# EAGLE design Control (EAGLE 9.6.2)
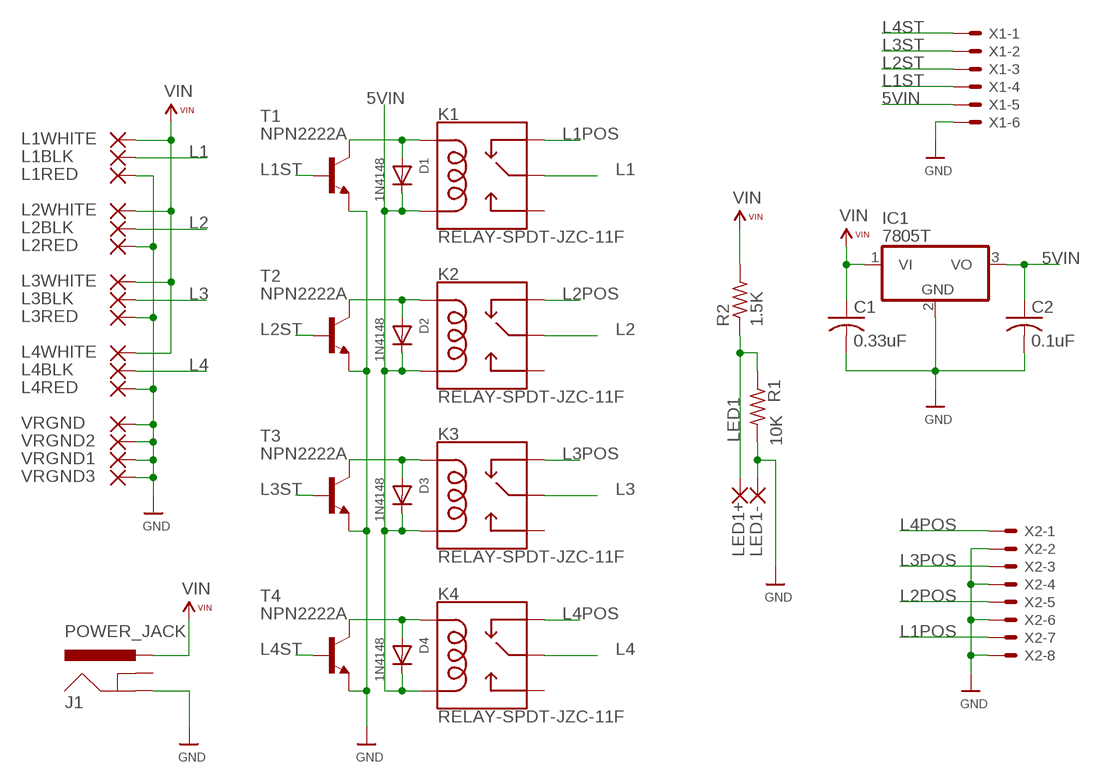
[diagram p0: schematic, sheet 1]

## Parts
C1  0.33uF  C-USC1206  [C1206]
C2  0.1uF  C-USC1206  [C1206]
D1  1N4148  DIODEDO-1N4148  [DO-1N4148]
D2  1N4148  DIODEDO-1N4148  [DO-1N4148]
D3  1N4148  DIODEDO-1N4148  [DO-1N4148]
D4  1N4148  DIODEDO-1N4148  [DO-1N4148]
IC1  7805T  [TO220H]
J1  POWER_JACK  [POWER_JACK_PTH]
K1  RELAY-SPDT-JZC-11F  [RELAY-JZC]
K2  RELAY-SPDT-JZC-11F  [RELAY-JZC]
K3  RELAY-SPDT-JZC-11F  [RELAY-JZC]
K4  RELAY-SPDT-JZC-11F  [RELAY-JZC]
L1BLK  SMD5  [SMD5,5X5]
L1RED  SMD5  [SMD5,5X5]
L1WHITE  SMD5  [SMD5,5X5]
L2BLK  SMD5  [SMD5,5X5]
L2RED  SMD5  [SMD5,5X5]
L2WHITE  SMD5  [SMD5,5X5]
L3BLK  SMD5  [SMD5,5X5]
L3RED  SMD5  [SMD5,5X5]
L3WHITE  SMD5  [SMD5,5X5]
L4BLK  SMD5  [SMD5,5X5]
L4RED  SMD5  [SMD5,5X5]
L4WHITE  SMD5  [SMD5,5X5]
LED1+  SMD5  [SMD2,54-5,08]
LED1-  SMD5  [SMD2,54-5,08]
R1  10K  R-US_M1206  [M1206]
R2  1.5K  R-US_M1206  [M1206]
T1  NPN2222A  2N5088  [TO92]
T2  NPN2222A  2N5088  [TO92]
T3  NPN2222A  2N5088  [TO92]
T4  NPN2222A  2N5088  [TO92]
VRGND  SMD5  [SMD5,5X5]
VRGND1  SMD5  [SMD5,5X5]
VRGND2  SMD5  [SMD5,5X5]
VRGND3  SMD5  [SMD5,5X5]
X1  KK-156-6  [KK-156-6]
X2  KK-156-8  [KK-156-8]

## Nets
5VIN: C2.1 D1.C D2.C D3.C D4.C IC1.3(VO) K1.1(COIL2) K2.1(COIL2) K3.1(COIL2) K4.1(COIL2) X1.5
GND: C1.2 C2.2 IC1.2(GND) J1.GND L1RED.1(P) L2RED.1(P) L3RED.1(P) L4RED.1(P) LED1-.1(P) R1.2 T1.3(E) T2.3(E) T3.3(E) T4.3(E) VRGND1.1(P) VRGND2.1(P) VRGND3.1(P) VRGND.1(P) X1.6 X2.2 X2.4 X2.6 X2.8
L1: K1.4(MAIN) L1BLK.1(P)
L1POS: K1.2(NC) X2.7
L1ST: T1.2(B) X1.4
L2: K2.4(MAIN) L2BLK.1(P)
L2POS: K2.2(NC) X2.5
L2ST: T2.2(B) X1.3
L3: K3.4(MAIN) L3BLK.1(P)
L3POS: K3.2(NC) X2.3
L3ST: T3.2(B) X1.2
L4: K4.4(MAIN) L4BLK.1(P)
L4POS: K4.2(NC) X2.1
L4ST: T4.2(B) X1.1
LED1: LED1+.1(P) R1.1 R2.1
N$6: D2.A K2.5(COIL1) T2.1(C)
N$7: D1.A K1.5(COIL1) T1.1(C)
N$8: D3.A K3.5(COIL1) T3.1(C)
N$9: D4.A K4.5(COIL1) T4.1(C)
VIN: C1.1 IC1.1(VI) J1.PWR L1WHITE.1(P) L2WHITE.1(P) L3WHITE.1(P) L4WHITE.1(P) R2.2
Unconnected: J1.GNDBREAK K1.3(NO) K2.3(NO) K3.3(NO) K4.3(NO)

## Library data of the parts
C1 C2 = adafruit:C-US: CAPACITOR, American symbol
D1-D4 = adafruit:DIODE: Diode SMADIODE - SMA Surface Mount Package 20V 1A Schottky Diode Digikey: 641-1014-6-ND DO-1N4148 - Through Hole Small Current Diode SOD-123 20V 1 A (.5mV Vf) Schottky Diode - Digikey: MBRX120TPMSCT-ND SOD-323 10V 570mA (.38mV Vf, 3ns) Schottky Diode - Digikey: ZLLS410CT-ND SOD-523 30V 30mA Schottky Diode (RB751S-40TE61) - Digikey: RB751S-40TE61CT-ND SOT23-R/W - SOT23 Package (R = Solder Paste/Reflow Ovens, W = Hand-Soldering) BAT54Film 40V 300mA - Digikey: 497-7162-1-ND
IC1 = linear:78*: Positive VOLTAGE REGULATOR Source: http://cache.national.com/ds/LM/LM78L05.pdf http://www.fairchildsemi.com/ds/LM/LM7805.pdf
J1 = SparkFun-Connectors:POWER_JACK: Power Jack Connector This is the standard 5.5mm barrel jack for power. The PTH is the most common, proven, reliable, footprint. The Slot footprint only works if the mill layer is transmitted to the PCB fab house so be warned. Here are the connectors we sell at SparkFun: DC Barrel Power Jack/Connector <https://www.sparkfun.com/products/119> (PRT-00119) DC Barrel Power Jack/Connector (SMD) <https://www.sparkfun.com/products/12748> (PRT-12748) DC Barrel Jack Adapter - Breadboard Compatible <https://www.sparkfun.com/products/10811> (PRT-10811) It is used on this SparkFun product (and many, many others): SparkFun RedBoard - Programmed with Arduino <https://www.sparkfun.com/products/12757> (DEV-12757) Also, if you need a mating power supply or connector, please check these out: Wall Adapter Power Supply - 9VDC 650mA <https://www.sparkfun.com/products/298> (TOL-00298) DC Barrel Jack Adapter - Male <https://www.sparkfun.com/products/10287> (PRT-10287); PROD_ID: CONN-08197
K1-K4 = SparkFun-Electromechanical:RELAY-SPDT: SPDT Electromechanical Relay Single-pole, double-throw sealed relays. When current is applied to the coil, it throws a simple changeover switch, terminating the connection from the NC contact to ground and closing the NO contact. Use them to switch high voltage/high current devices. SparkFun Products JQX-15F: Relay SPDT Sealed - 20A <https://www.sparkfun.com/products/10924> (COM-10924) JZC-11F: Relay SPDT Sealed <https://www.sparkfun.com/products/100> (COM-00100); PROD_ID: COMP-09533; SF_SKU: COM-00100
L1BLK L1RED L1WHITE L2BLK L2RED L2WHITE L3BLK L3RED L3WHITE L4BLK L4RED L4WHITE VRGND VRGND1-VRGND3 = Wirepad 5x5mm:SMD5: SMD PAD
LED1+ LED1- = wirepad:SMD5: SMD PAD
R1 R2 = BeagleBone_Black_Wireless:R-US_: RESISTOR, American symbol
T1-T4 = transistor:2N5088: NPN TRANSISTOR
X1 = con-molex:KK-156-6: KK 156 HEADER Source: http://www.molex.com/pdm_docs/sd/026604100_sd.pdf; MF: MOLEX; OC_FARNELL: unknown; OC_NEWARK: unknown
X2 = con-molex:KK-156-8: KK 156 HEADER Source: http://www.molex.com/pdm_docs/sd/026604100_sd.pdf; MF: MOLEX; OC_FARNELL: unknown; OC_NEWARK: unknown

## Board
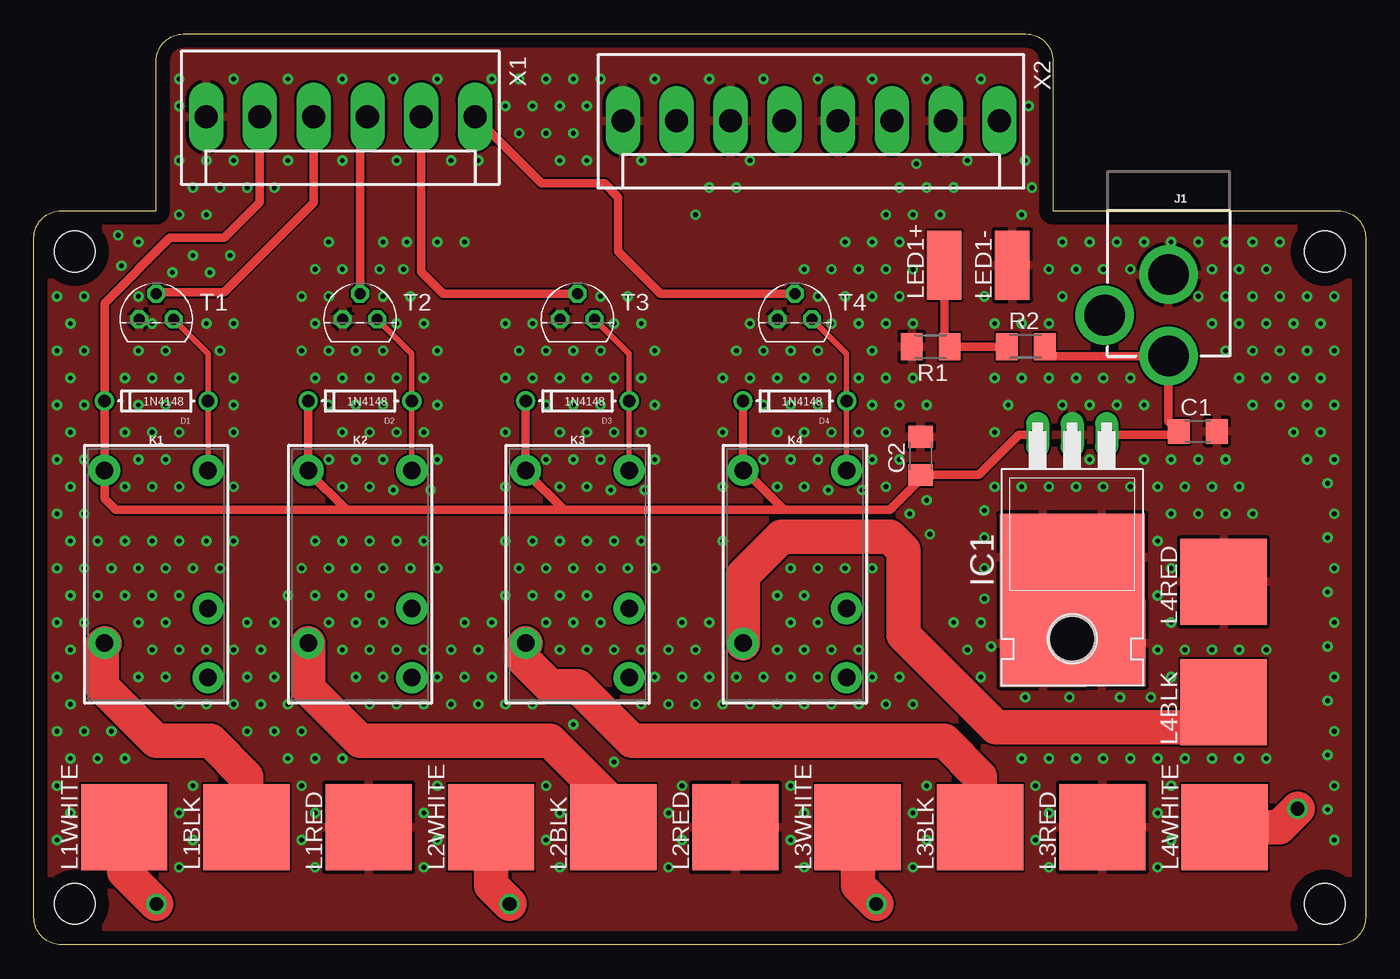
[diagram p1: board, top side]
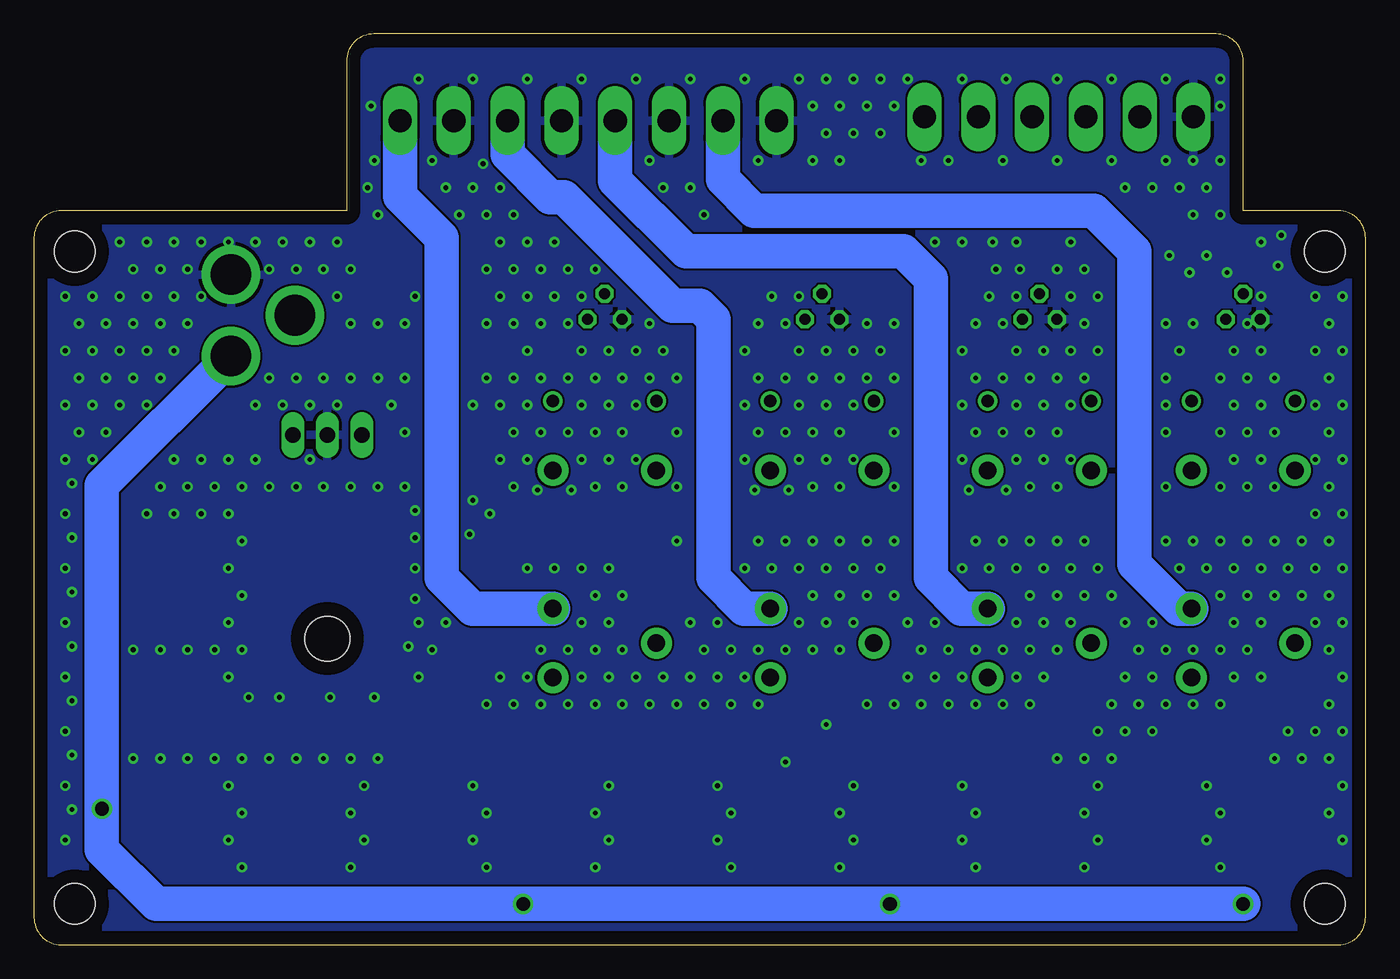
[diagram p2: board, bottom side, seen from below]

Size 98 x 67 mm. Coordinates in mm from the lower left corner, seen from the top.
Outline: 75,54 96,54 arc-90 98,52 98,2 arc-90 96,0 2,0 arc-90 0,2 0,52 arc-90 2,54 9,54 9,65 arc-90 11,67 73,67 arc-90 75,65 75,54
Copper layers (1*16): Top 0.035mm / dielectric 1.5mm / Bottom 0.035mm
Design rules "default": minimum track width 6mil, minimum drill 0.35mm, track to track 6mil, track to pad 6mil, pad to pad 6mil, via to via 6mil, smd to smd 6mil, copper to edge 40mil, drill to drill 6mil, minimum pad ring 10mil, minimum via ring 8mil, stop-mask expansion 4mil, vias tented up to drill 0.5mm, thermal gap 10mil
Holes 3 mm at 3,51 3,3 95,3 95,51

### Footprints (pad centres in the part's own frame; a part is rotated, then mirrored left to right if it is on the bottom)
C1206 = smd 1.6 x 1.8: 1 -1.4,0; 2 1.4,0
DO-1N4148 = drill 0.9: A -3.81,0; C 3.81,0
TO220H = drill 1.118 long: 1 -2.54,-10.16; 2 0,-10.16; 3 2.54,-10.16 | hole 3.302: 0,4.826
POWER_JACK_PTH = drill 2.997 pad 4.318: GND 0,7.7; GNDBREAK 4.7,10.7; PWR 0,13.7
RELAY-JZC = drill 1.3 pad 2.286: 1 3.81,-8.89; 2 -3.81,1.27; 3 -3.81,6.35; 4 3.81,3.81; 5 -3.81,-8.89
SMD5,5X5 = smd 6.35 x 6.35: 1 0.635,0.635
SMD2,54-5,08 = smd 2.54 x 5.08: 1 0,0
M1206 = smd 1.6 x 2: 1 -1.4,0; 2 1.4,0
TO92 = drill 0.813 octagon: 1 1.27,0; 2 0,1.905; 3 -1.27,0
KK-156-6 = drill 1.7 pad 2.184 long: 1 -9.9,0; 2 -5.94,0; 3 -1.98,0; 4 1.98,0; 5 5.94,0; 6 9.9,0
KK-156-8 = drill 1.7 pad 2.184 long: 1 -13.86,0; 2 -9.9,0; 3 -5.94,0; 4 -1.98,0; 5 1.98,0; 6 5.94,0; 7 9.9,0; 8 13.86,0

### Placement (x,y rotation side)
C1  85.65,37.77 0 top
C2  65.25,35.96 90 top
D1  9,40 180 top
D2  24,40 180 top
D3  40,40 180 top
D4  56,40 180 top
IC1  76.41,27.34 180 top
J1  83.5,57 180 top
K1  9,26 180 top
K2  24,26 180 top
K3  40,26 180 top
K4  56,26 180 top
L1BLK  15,8 0 top
L1RED  24,8 0 top
L1WHITE  6,8 0 top
L2BLK  42,8 0 top
L2RED  51,8 0 top
L2WHITE  33,8 0 top
L3BLK  69,8 0 top
L3RED  78,8 0 top
L3WHITE  60,8 0 top
L4BLK  86.92,17.2 0 top
L4RED  86.92,26.07 0 top
L4WHITE  87,8 0 top
LED1+  67,50 0 top
LED1-  72,50 0 top
R1  66,44 180 top
R2  73,44 0 top
T1  9,46 0 top
T2  24,46 0 top
T3  40,46 0 top
T4  56,46 0 top
VRGND  77.97,21.55 0 top
VRGND1  73.62,27.88 0 top
VRGND2  77.95,27.88 0 top
VRGND3  73.62,21.53 0 top
X1  22.56,60.9 180 top
X2  57.2,60.63 180 top

### Tracks (layer width: path | path; a pad name or v marks a point on that pad's centre or on a via)
5VIN
  Top 0.61: D2.C K2.1 20.19,34.81 23,32 | D3.C K3.1 36.19,34.81 39,32 | K4.1 52.19,35 | 52.19,35 D4.C | 23,32 6,32 5.19,32.81 K1.1 D1.C 5.19,47.19 10,52 14,52 16.62,54.62 X1.5 | 23,32 39,32 | 39,32 55.19,32 | 55.19,32 63,32 65.25,34.25 C2.1 69.56,34.56 72.5,37.5 IC1.3 | 55.19,32 52.19,35
GND  (via drill 0.35)
  other vias: 1.7,7.7 2.7,9.7 1.7,11.7 2.7,13.7 1.7,15.7 2.7,17.7 1.7,19.7 2.7,21.7 1.7,23.7 2.7,25.7 1.7,27.7 2.7,29.7 1.7,31.7 2.7,33.7 1.7,35.7 2.7,37.7 1.7,39.7 2.7,41.7 1.7,43.7 2.7,45.7 1.7,47.7 4.7,13.7 3.7,15.7 3.7,23.7 4.7,25.7 3.7,27.7 4.7,29.7 3.7,31.7 3.7,35.7 3.7,39.7 3.7,43.7 3.7,47.7 6.7,13.7 5.7,15.7 6.7,25.7 5.7,27.7 6.7,29.7 6.7,33.7 6.7,37.7 6.7,41.7 6.45,49.95 6.2,52.2 7.7,19.7 8.7,21.7 7.7,23.7 8.7,25.7 7.7,27.7 8.7,29.7 8.7,33.7 7.7,35.7 8.7,37.7 7.7,39.7 8.7,41.7 7.7,43.7 8.7,45.7 7.7,47.7 7.7,51.7 10.7,5.7 10.7,9.7 10.7,17.7 9.7,19.7 10.7,21.7 9.7,23.7 10.7,25.7 9.7,27.7 10.7,29.7 10.7,33.7 9.7,35.7 10.7,37.7 9.7,39.7 10.7,41.7 9.7,43.7 10.2,49.45 10.7,53.7 10.7,57.7 10.7,61.7 11.7,7.7 11.7,11.7 12.7,17.7 12.7,21.7 11.7,27.7 12.7,29.7 12.7,45.7 12.95,49.45 12.7,53.7 11.7,55.7 12.7,57.7 10.7,63.7 14.7,17.7 14.7,21.7 13.7,27.7 14.7,29.7 14.7,33.7 14.7,37.7 14.7,39.7 14.7,41.7 13.7,43.7 14.7,45.7 14.45,50.7 13.7,55.7 14.7,57.7 14.7,63.7 15.7,15.7 16.7,17.7 15.7,19.7 16.7,21.7 15.7,23.7 11.7,50.7 15.7,55.7 18.7,13.7 17.7,15.7 18.7,17.7 17.7,19.7 17.7,23.7 18.7,25.7 17.7,55.7 18.7,57.7 18.7,63.7 20.7,5.7 19.7,7.7 20.7,9.7 19.7,11.7 20.7,13.7 19.7,15.7 20.7,25.7 19.7,27.7 20.7,29.7 20.7,41.7 19.7,43.7 20.7,45.7 19.7,47.7 20.7,49.7 22.7,13.7 22.7,21.7 21.7,23.7 22.7,25.7 21.7,27.7 22.7,29.7 22.7,33.7 21.7,35.7 22.7,37.7 21.7,39.7 22.7,41.7 21.7,43.7 21.7,47.7 22.7,49.7 21.7,51.7 22.7,57.7 22.7,63.7 24.7,17.7 23.7,19.7 24.7,21.7 23.7,23.7 24.7,25.7 23.7,27.7 24.7,29.7 24.7,33.7 23.7,35.7 24.7,37.7 23.7,39.7 24.7,41.7 23.7,43.7 25.45,49.7 26.7,17.7 25.7,19.7 26.7,21.7 25.7,23.7 25.7,27.7 26.7,29.7 26.45,33.45 25.7,35.7 26.7,37.7 25.7,39.7 26.7,41.7 25.7,43.7 26.7,45.7 25.7,47.7 27.2,49.7 25.7,51.7 26.7,57.7 26.45,63.7 28.7,5.7 28.7,9.7 28.7,17.7 28.7,21.7 27.7,27.7 28.7,29.7 29.2,33.45 28.7,37.7 28.7,41.7 28.7,45.7 27.7,47.7 27.45,51.7 29.7,7.7 29.7,11.7 30.7,17.7 29.7,19.7 30.7,21.7 29.7,27.7 29.7,35.7 29.7,39.7 29.7,43.7 29.7,51.7 30.7,57.7 29.7,63.7 32.7,17.7 31.7,19.7 32.7,21.7 31.7,23.7 31.7,51.7 32.7,57.7 34.7,17.7 33.7,19.7 33.7,23.7 34.7,25.7 34.7,29.7 34.7,33.7 34.7,37.7 34.7,41.7 34.7,45.7 34.7,61.7 33.7,63.7 36.7,17.7 36.7,25.7 35.7,27.7 36.7,29.7 36.7,41.7 35.7,43.7 36.7,45.7 35.7,59.7 36.7,61.7 35.7,63.7 38.7,5.7 37.7,7.7 38.7,9.7 37.7,11.7 38.7,21.7 37.7,23.7 38.7,25.7 37.7,27.7 38.7,29.7 38.7,33.7 37.7,35.7 38.7,37.7 37.7,39.7 38.7,41.7 37.7,43.7 38.7,57.7 37.7,59.7 38.7,61.7 37.7,63.7 39.7,16.2 40.7,21.7 39.7,23.7 40.7,25.7 39.7,27.7 40.7,29.7 40.7,33.7 39.7,35.7 40.7,37.7 39.7,39.7 40.7,41.7 39.7,43.7 40.7,57.7 39.7,59.7 40.7,61.7 39.7,63.7 42.7,13.45 42.7,21.7 41.7,23.7 41.7,27.7 42.7,29.7 42.45,33.45 41.7,35.7 42.7,37.7 41.7,39.7 42.7,41.7 41.7,43.7 42.7,45.7 41.7,47.7 41.7,63.7 44.7,17.7 44.7,21.7 43.7,27.7 44.7,29.7 44.95,33.45 44.7,37.7 44.7,41.7 44.7,45.7 43.7,47.7 44.7,57.7 46.7,5.7 46.7,9.7 46.7,17.7 45.7,19.7 46.7,21.7 45.7,27.7 45.7,35.7 45.7,39.7 45.7,43.7 45.7,63.7 47.7,7.7 47.7,11.7 48.7,17.7 47.7,19.7 48.7,21.7 47.7,23.7 48.7,53.7 50.7,17.7 49.7,19.7 49.7,23.7 50.7,29.7 50.7,33.7 50.7,37.7 50.7,41.7 49.7,55.7 49.7,63.7 52.7,17.7 51.7,19.7 52.7,41.7 51.7,43.7 52.7,45.7 51.7,55.7 52.7,57.7 54.7,17.7 53.7,19.7 54.7,21.7 54.7,25.7 54.7,33.7 53.7,35.7 54.7,37.7 53.7,39.7 54.7,41.7 53.7,43.7 53.7,63.7 56.7,5.7 55.7,7.7 56.7,9.7 55.7,11.7 56.7,17.7 55.7,19.7 56.7,21.7 55.7,23.7 56.7,25.7 55.7,27.7 56.7,33.7 55.7,35.7 56.7,37.7 55.7,39.7 56.7,41.7 55.7,43.7 56.7,49.7 58.7,17.7 57.7,19.7 58.7,21.7 57.7,23.7 57.7,27.7 58.45,33.45 57.7,35.7 58.7,37.7 57.7,39.7 58.7,41.7 57.7,43.7 58.7,45.7 57.7,47.7 58.7,49.7 57.7,63.7 60.7,17.7 60.7,21.7 59.7,27.7 60.95,33.45 60.7,37.7 60.7,41.7 60.7,45.7 59.7,47.7 60.7,49.7 59.7,51.7 62.7,17.7 61.7,19.7 61.7,27.7 62.7,33.7 61.7,35.7 62.7,37.7 61.7,39.7 62.7,41.7 61.7,43.7 62.7,45.7 61.7,47.7 62.7,49.7 61.7,51.7 62.7,53.7 61.7,63.7 64.7,5.7 64.7,9.7 64.7,17.7 63.7,19.7 64.45,31.7 63.7,35.7 63.7,39.7 64.7,41.7 64.7,45.7 63.7,47.7 64.7,49.7 63.7,51.7 64.7,53.7 63.7,55.7 64.95,57.45 73.45,55.7 65.7,7.7 65.7,11.7 65.95,30.2 65.7,32.7 65.7,39.7 66.7,53.7 65.7,55.7 65.7,63.7 68.7,21.7 67.7,23.7 67.7,55.7 68.7,57.7 69.7,19.7 70.45,21.95 69.7,23.7 69.95,27.7 70.7,33.7 70.7,37.7 70.7,41.7 70.7,45.7 69.95,47.7 69.7,63.7 72.7,13.7 72.95,18.2 72.7,33.7 71.7,39.7 72.7,41.7 72.7,45.7 72.7,53.7 72.95,57.7 73.2,61.7 74.7,5.7 73.7,7.7 74.7,9.7 73.7,11.7 74.7,13.7 69.95,31.95 74.7,33.7 74.7,41.7 74.7,45.7 74.7,49.7 76.7,13.7 76.7,33.7 75.7,39.7 76.7,41.7 75.7,47.7 76.7,49.7 75.7,51.7 78.7,13.7 69.95,25.45 69.95,29.95 78.7,33.7 77.7,35.7 77.7,39.7 78.7,41.7 78.7,49.7 77.7,51.7 80.7,13.7 79.95,18.2 80.7,33.7 79.7,39.7 80.7,41.7 80.7,49.7 79.7,51.7 82.7,5.7 82.7,9.7 82.7,13.7 82.7,21.7 82.7,25.7 82.7,29.7 82.7,33.7 81.7,35.7 81.7,39.7 81.7,51.7 83.7,7.7 83.7,11.7 84.7,13.7 83.7,19.7 84.7,21.7 83.7,23.7 83.7,27.7 83.7,31.7 84.7,33.7 83.7,35.7 83.7,51.7 86.7,13.7 86.7,21.7 85.7,31.7 86.7,33.7 85.7,35.7 86.7,45.7 85.7,47.7 86.7,49.7 85.7,51.7 88.7,13.7 88.7,21.7 82.2,18.2 76.2,18.2 87.7,31.7 88.7,33.7 87.7,35.7 88.7,41.7 87.7,43.7 88.7,45.7 87.7,47.7 88.7,49.7 87.7,51.7 90.7,13.7 90.7,21.7 89.7,31.7 89.7,39.7 90.7,41.7 89.7,43.7 90.7,45.7 89.7,47.7 90.7,49.7 89.7,51.7 92.7,37.7 91.7,39.7 92.7,41.7 91.7,43.7 92.7,45.7 91.7,47.7 91.7,51.7 95.2,9.95 95.2,13.95 95.2,17.95 95.2,21.95 95.2,25.95 95.2,29.95 95.2,33.95 93.7,35.7 94.7,37.7 93.7,39.7 94.7,41.7 93.7,43.7 94.7,45.7 93.7,47.7 95.7,7.7 95.7,11.7 95.7,15.7 95.7,19.7 95.7,23.7 95.7,27.7 95.7,31.7 95.7,35.7 95.7,39.7 95.7,43.7 95.7,47.7
  pour Bottom: 0,0 0,54 9,54 9,67 75,67 75,54 98,54 98,0
  pour Top: 0,0 0,54 9,54 9,67 75,67 75,54 98,54 98,0
L1
  Top 2.54: L1BLK.1 15.63,12.37 13,15 9,15 5,19 5,22 K1.4
L1POS
  Bottom 2.54: K1.2 13.73,24.73 17,28 17,51 20,54 45,54 47.3,56.3 X2.7
L1ST
  Top 0.61: T1.2 9.1,48 14,48 20.58,54.58 X1.4
L2
  Top 2.54: L2BLK.1 42,9.27 42,11 38,15 24,15 20.19,18.81 K2.4
L2POS
  Bottom 2.54: K2.2 29.73,24.73 32,27 32,49 34,51 50,51 55.22,56.22 X2.5
L2ST
  Top 0.61: T2.2 24,60.36 X1.3
L3
  Top 2.54: L3BLK.1 69.64,12.37 67,15 44,15 40,19 38,19 36,21 36,22 K3.4
L3POS
  Bottom 2.54: K3.2 45.73,24.73 48,27 48,46 49,47 51,47 59,55 60,55 63.14,58.14 X2.3
L3ST
  Top 0.61: X1.2 28.5,49.5 30.09,47.91 T3.2
L4
  Top 2.54: L4BLK.1 85.72,16 70.81,16 64,22.81 64,29 63,30 55,30 52.19,27.19 K4.4
L4POS
  Bottom 2.54: K4.2 65.73,24.73 68,27 68,52 71.06,55.06 X2.1
L4ST
  Top 0.61: X1.1 37.36,56 42,56 43,55 43,51 46.09,47.91 T4.2
LED1
  Top 0.61: R2.1 R1.1 67,44.4 LED1+.1
N$6
  Top 0.406: K2.5 D2.A 27.81,43.46 T2.1
N$7
  Top 0.406: K1.5 D1.A 12.81,43.46 T1.1
N$8
  Top 0.406: K3.5 D3.A 43.81,43.46 T3.1
N$9
  Top 0.406: K4.5 D4.A 59.81,43.46 T4.1 | K4.5 59.81,34.19 60,34 60,34.7 K4.5
VIN  (via drill 1)
  Top 0.61: IC1.1 83.98,37.5 C1.1 83.5,38.52 J1.PWR 75.1,43.3 R2.2
  Top 2.54: v9,3 6.63,5.37 L1WHITE.1 | L2WHITE.1 33.63,4.37 v35,3 | L3WHITE.1 60.63,4.37 v62,3 | L4WHITE.1 91.64,8.63 v93,10
  Bottom 2.54: J1.PWR 93,33.8 v93,10 93,7 89,3 v62,3 v35,3 v9,3